# Altium schematic sheet SPI.SchDoc
size A4
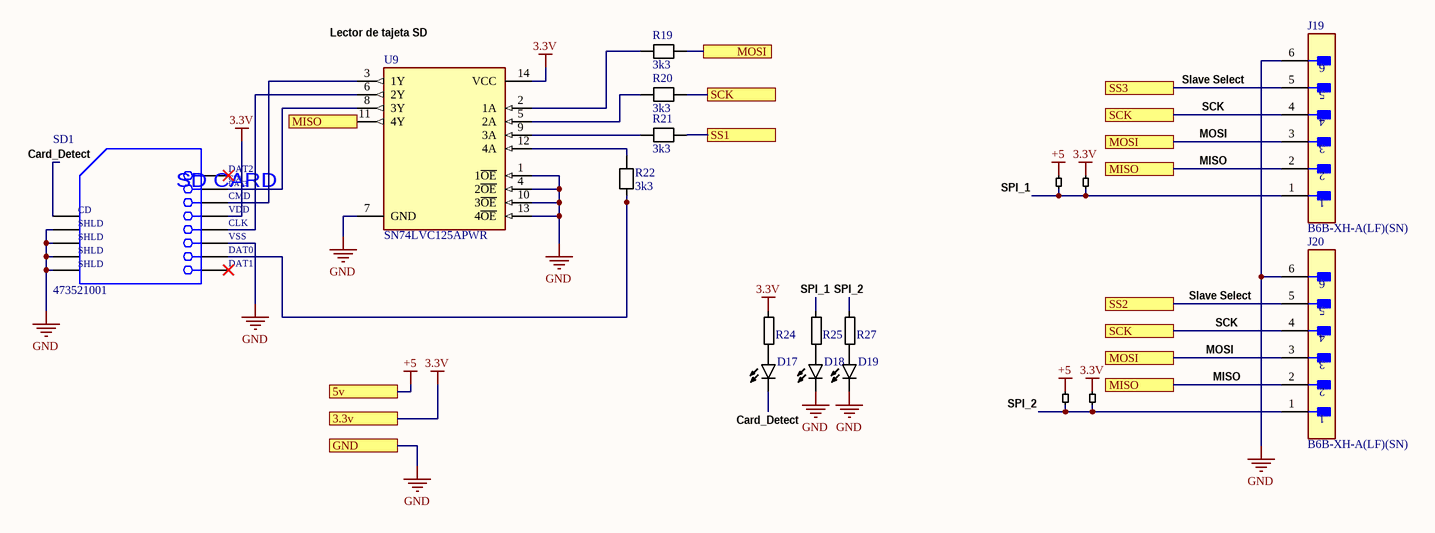
[diagram p0: SPI.SchDoc]

## Parts
D17  597-3305-607F  [0805 LED]  (value not drawn)
D18  597-3305-607F  [0805 LED]  (value not drawn)
D19  597-3305-607F  [0805 LED]  (value not drawn)
J19  B6B-XH-A(LF)(SN)  [FP-B6B-XH-A_LF_SN-MFG]
J20  B6B-XH-A(LF)(SN)  [FP-B6B-XH-A_LF_SN-MFG]
R19  3k3  [1206]
R20  3k3  [1206]
R21  3k3  [1206]
R22  3k3  [1206]
R24  CR0805-JW-221ELF  [0805 res]  (value not drawn)
R25  CR0805-JW-221ELF  [0805 res]  (value not drawn)
R27  CR0805-JW-221ELF  [0805 res]  (value not drawn)
SD1  473521001  [MOLX-473521001_V]
U9  SN74LVC125APWR  [FP-PW0014A-IPC_B]
W2  Jumper  [Jumper Mid]  (value not drawn)
W9  Jumper  [Jumper Mid]  (value not drawn)
W10  Jumper  [Jumper Mid]  (value not drawn)
W11  Jumper  [Jumper Mid]  (value not drawn)

## Ports
3.3v, 5v, GND, MISO, MOSI, SCK, SS1, SS2, SS3

## Nets
3.3V: R24.1 SD1.4(VDD) U9.14(VCC) W10.2 W11.2 ; port 3.3v
+5: W2.2 W9.2 ; port 5v
GND: D18.C D19.C J19.6 J20.6 SD1.6(VSS) SD1.10(SHLD) SD1.11(SHLD) SD1.12(SHLD) SD1.13(SHLD) U9.1(1~{OE}) U9.4(2~{OE}) U9.7(GND) U9.10(3~{OE}) U9.13(4~{OE}) ; port GND
Card_Detect: D17.C SD1.9(CD)
MISO: J19.2 J20.2 U9.11(4Y) ; port MISO
MOSI: J19.3 J20.3 R19.2 ; port MOSI
SCK: J19.4 J20.4 R20.2 ; port SCK
SPI_1: J19.1 R25.1 W2.1 W10.1
SPI_2: J20.1 R27.1 W9.1 W11.1
SS1: R21.2 ; port SS1
SS2: J20.5 ; port SS2
SS3: J19.5 ; port SS3
NetD17_A: D17.A R24.2
NetD18_A: D18.A R25.2
NetD19_A: D19.A R27.2
NetR19_1: R19.1 U9.2(1A)
NetR20_1: R20.1 U9.5(2A)
NetR21_1: R21.1 U9.9(3A)
NetR22_1: R22.1 U9.12(4A)
NetR22_2: R22.2 SD1.7(DAT0)
NetSD1_2: SD1.2(CD/DAT3) U9.8(3Y)
NetSD1_3: SD1.3(CMD) U9.3(1Y)
NetSD1_5: SD1.5(CLK) U9.6(2Y)

Not connected (* = marked no-connect by the designer): SD1 1(DAT2)* 8(DAT1)*

## Notes on the sheet
- (near U9) Lector de tajeta SD
- Slave Select
- SCK
- MOSI
- MISO
- (near J20) Slave Select
- (in symbol CMP-2000-05848-1) CD/; DAT3; SD CARD

## Library data of the parts
D17-D19 = 597-3305-607F: LED Uni-Color Green 4-Pin Chip 0805 T/R; Availability: Unavailable; Value: *; Price: None; MP: 597-3305-607F; Package: None
J19 J20 = CMP-17439-000076-1: CONN HEADER VERT 6POS 2.5MM
R19-R22 = RGC1206DTC10K0: Package: None; Price: None; Value: *; MP: RGC1206DTC10K0; Availability: Unavailable
R24 R25 R27 = CR0805-JW-221ELF: 220 Ohms Â±5% 0.125W, 1/8W Chip Resistor 0805 (2012 Metric) Moisture Resistant Thick Film; MF: Bourns; Value: *; Check_prices: https://www.snapeda.com/parts/CR0805-JW-221ELF/Bourns/view-part/?ref=eda; MP: CR0805-JW-221ELF; Price: None; Package: 2012 Bourns; Availability: In Stock; SnapEDA_Link: https://www.snapeda.com/parts/CR0805-JW-221ELF/Bourns/view-part/?ref=snap; Purchase-URL: https://pricing.snapeda.com/search/part/CR0805-JW-221ELF/?ref=eda
SD1 = CMP-2000-05848-1: MicroSD(TM), Pitch 1.1 mm, 8 Position, Height 1.88 mm, -20 to 85 degC, RoHS, Tape and Reel; Manufacturer: Molex; Datasheet Version: Rev. G, 01/2012; Datasheet URL: http://www.molex.com/pdm_docs/sd/473521001_sd.pdf; Package Reference: 473521001; Manufacturer URL: http://www.molex.com/; Mounting Technology: SurfaceMount; Package Description: MicroSD(TM), Pitch 1.1 mm, 8 Position, Height 1.88 mm
U9 = CMP-0440-00179-4: IC BUF NON-INVERT 3.6V 14TSSOP; Max Power Dissipation: 500mW; Number of Bits per Element: 1; Number of Bits: 4; Quiescent Current: 1uA; Min Supply Voltage: 1.65V; Propagation Delay: 4.6ns; High Level Output Current: -24mA; Logic Function: Buffer; Low Level Output Current: 24mA; Polarity: Non-Inverting; Turn-On Delay Time: 5.3ns; Number of Output Lines: 3; Mount: Surface Mount; Lead Free: Lead Free; Number of Outputs: 4; Max Supply Voltage: 3.6V; Packaging: Tape and Reel; Radiation Hardening: No; Number of Channels: 4; REACH SVHC: No SVHC; Length: 5mm; Number of Elements: 4; Contact Plating: Gold; Case/Package: TSSOP; Number of Input Lines: 4; Number of Inputs: 4; Height: 1.15mm; Number of Circuits: 4; Termination: SMD/SMT; Min Operating Temperature: -40°C; Package Quantity: 1; Number of Gates: 4; Max Operating Temperature: 125°C; Width: 4.4mm; Number of Pins: 14